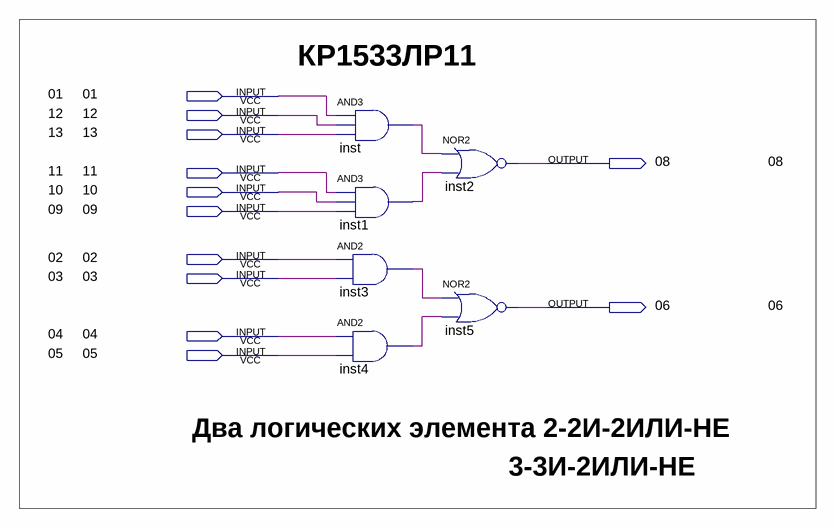
[diagram p0: schematic sheet]
// Quartus schematic KP1533LR11.bdf as structural Verilog: 6 symbols, 12 pins
module KP1533LR11 (
  input  \01 ,
  input  \12 ,
  input  \13 ,
  input  \11 ,
  input  \10 ,
  input  \09 ,
  input  \02 ,
  input  \03 ,
  input  \04 ,
  input  \05 ,
  output \08 ,
  output \06 
);

  wire inst1_out, inst3_out, inst4_out, inst_out;

  and inst (inst_out, \01 , \12 , \13 );
  and inst1 (inst1_out, \11 , \10 , \09 );
  and inst3 (inst3_out, \02 , \03 );
  and inst4 (inst4_out, \04 , \05 );
  nor inst2 (\08 , inst_out, inst1_out);
  nor inst5 (\06 , inst3_out, inst4_out);

  // Notes on the sheet:
  //   КР1533ЛР11
  //   01
  //   12
  //   13
  //   08
  //   11
  //   10
  //   09
  //   02
  //   03
  //   06
  //   04
  //   05
  //   Два логических элемента 2-2И-2ИЛИ-НЕ
  //   3-3И-2ИЛИ-НЕ
endmodule
